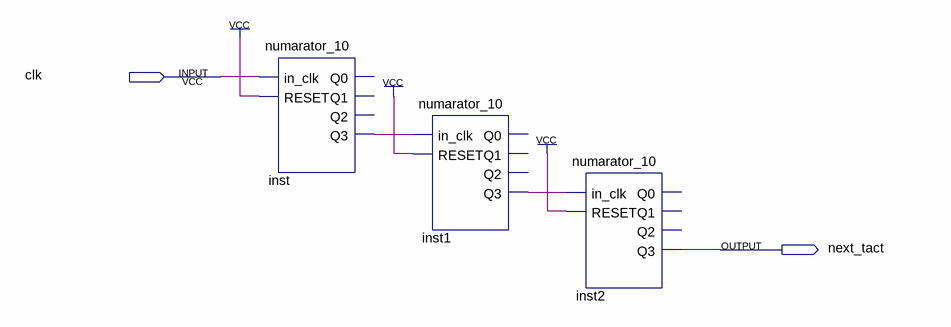
[diagram p0: schematic sheet]
// Quartus schematic divizor_1000.bdf as structural Verilog: 3 symbols, 2 pins
module divizor_1000 (
  input  clk,
  output next_tact
);

  wire inst1_q3, inst_q3;

  numarator_10 inst (.in_clk(clk), .RESET(1'b1), .Q3(inst_q3));  // open: Q0, Q1, Q2
  numarator_10 inst1 (.in_clk(inst_q3), .RESET(1'b1), .Q3(inst1_q3));  // open: Q0, Q1, Q2
  numarator_10 inst2 (.in_clk(inst1_q3), .RESET(1'b1), .Q3(next_tact));  // open: Q0, Q1, Q2
endmodule
